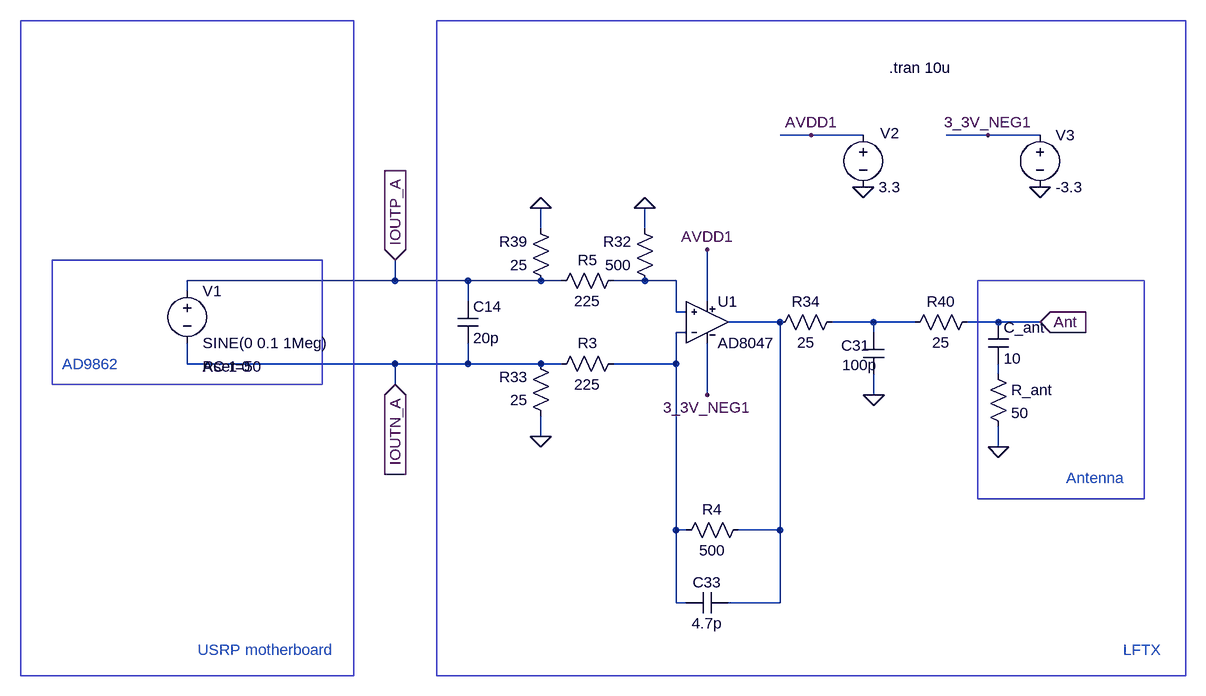
[diagram p0: schematic LFTX-AD8047.asc]
LFTX-AD8047.asc, the LTspice schematic file:
Version 4
SHEET 1 1508 724
WIRE -96 -112 -144 -112
WIRE -16 -112 -96 -112
WIRE 176 -112 112 -112
WIRE 256 -112 176 -112
WIRE -512 32 -512 0
WIRE -352 32 -352 0
WIRE -736 112 -736 80
WIRE -736 112 -1056 112
WIRE -624 112 -736 112
WIRE -512 112 -624 112
WIRE -480 112 -512 112
WIRE -352 112 -400 112
WIRE -304 112 -352 112
WIRE -1056 128 -1056 112
WIRE -624 144 -624 112
WIRE -256 144 -256 64
WIRE -304 160 -304 112
WIRE -288 160 -304 160
WIRE -144 176 -224 176
WIRE 0 176 -64 176
WIRE 64 176 0 176
WIRE 192 176 144 176
WIRE 256 176 192 176
WIRE -288 192 -304 192
WIRE 0 192 0 176
WIRE -1056 240 -1056 208
WIRE -736 240 -1056 240
WIRE -624 240 -624 208
WIRE -624 240 -736 240
WIRE -512 240 -624 240
WIRE -480 240 -512 240
WIRE -304 240 -304 192
WIRE -304 240 -400 240
WIRE 192 256 192 240
WIRE -736 272 -736 240
WIRE -256 288 -256 208
WIRE 0 288 0 256
WIRE -512 352 -512 320
WIRE 192 368 192 336
WIRE -304 496 -304 240
WIRE -288 496 -304 496
WIRE -144 496 -144 176
WIRE -144 496 -208 496
WIRE -304 608 -304 496
WIRE -288 608 -304 608
WIRE -144 608 -144 496
WIRE -144 608 -224 608
FLAG -512 0 0
FLAG -352 0 0
FLAG 256 176 Ant
IOPIN 256 176 In
FLAG -512 352 0
FLAG -96 -112 AVDD1
FLAG -16 -32 0
FLAG -736 80 IOUTP_A
IOPIN -736 80 In
FLAG -736 272 IOUTN_A
IOPIN -736 272 In
FLAG 256 -32 0
FLAG 176 -112 3_3V_NEG1
FLAG -256 64 AVDD1
FLAG -256 288 3_3V_NEG1
FLAG 0 288 0
FLAG 192 368 0
SYMBOL res -384 96 R90
WINDOW 0 0 56 VBottom 0
WINDOW 3 32 56 VTop 0
SYMATTR InstName R5
SYMATTR Value 225
SYMATTR SpiceLine tol=1 pwr=0.1
SYMBOL res -496 336 R180
WINDOW 0 36 76 Left 0
WINDOW 3 36 40 Left 0
SYMATTR InstName R33
SYMATTR Value 25
SYMATTR SpiceLine tol=1 pwr=0.1
SYMBOL res -336 128 R180
WINDOW 0 36 76 Left 0
WINDOW 3 36 40 Left 0
SYMATTR InstName R32
SYMATTR Value 500
SYMATTR SpiceLine tol=1 pwr=0.1
SYMBOL res -496 256 R270
WINDOW 0 32 56 VTop 0
WINDOW 3 0 56 VBottom 0
SYMATTR InstName R3
SYMATTR Value 225
SYMATTR SpiceLine tol=1 pwr=0.1
SYMBOL res 160 160 R90
WINDOW 0 0 56 VBottom 0
WINDOW 3 32 56 VTop 0
SYMATTR InstName R40
SYMATTR Value 25
SYMATTR SpiceLine tol=1 pwr=0.1
SYMBOL res -496 128 R180
WINDOW 0 36 76 Left 0
WINDOW 3 36 40 Left 0
SYMATTR InstName R39
SYMATTR Value 25
SYMATTR SpiceLine tol=1 pwr=0.1
SYMBOL res -48 160 R90
WINDOW 0 0 56 VBottom 0
WINDOW 3 32 56 VTop 0
SYMATTR InstName R34
SYMATTR Value 25
SYMATTR SpiceLine tol=1 pwr=0.1
SYMBOL cap -16 192 R0
WINDOW 0 -34 20 Left 0
WINDOW 3 -32 50 Left 0
SYMATTR InstName C31
SYMATTR Value 100p
SYMBOL voltage -1056 112 R0
WINDOW 123 24 132 Left 0
WINDOW 39 24 132 Left 0
SYMATTR Value2 AC 1 0
SYMATTR SpiceLine Rser=50
SYMATTR InstName V1
SYMATTR Value SINE(0 0.1 1Meg)
SYMBOL voltage -16 -128 R0
WINDOW 123 0 0 Left 0
WINDOW 39 0 0 Left 0
WINDOW 0 26 13 Left 0
SYMATTR InstName V2
SYMATTR Value 3.3
SYMBOL cap -640 144 R0
SYMATTR InstName C14
SYMATTR Value 20p
SYMBOL AD8047 -256 112 R0
SYMATTR InstName U1
SYMBOL voltage 256 -128 R0
WINDOW 123 0 0 Left 0
WINDOW 39 0 0 Left 0
SYMATTR InstName V3
SYMATTR Value -3.3
SYMBOL res -192 480 R90
WINDOW 0 0 56 VBottom 0
WINDOW 3 32 56 VTop 0
SYMATTR InstName R4
SYMATTR Value 500
SYMATTR SpiceLine tol=1 pwr=0.1
SYMBOL cap -224 592 R90
WINDOW 0 0 32 VBottom 0
WINDOW 3 32 32 VTop 0
SYMATTR InstName C33
SYMATTR Value 4.7p
SYMBOL cap 176 176 R0
SYMATTR InstName C_ant
SYMATTR Value 10
SYMBOL res 176 240 R0
SYMATTR InstName R_ant
SYMATTR Value 50
TEXT 24 -216 Left 0 !.tran 10u
TEXT -1248 240 Left 0 ;AD9862
TEXT 296 416 Left 0 ;Antenna
TEXT 384 680 Left 0 ;LFTX
TEXT -1040 680 Left 0 ;USRP motherboard
RECTANGLE Normal -1264 272 -848 80
RECTANGLE Normal 416 448 160 112
RECTANGLE Normal -672 720 480 -288
RECTANGLE Normal -1312 720 -800 -288

The netlist it stands for:
* LFTX-AD8047.asc
R5 N001 IOUTP_A 225 tol=1 pwr=0.1
R33 0 IOUTN_A 25 tol=1 pwr=0.1
R32 N001 0 500 tol=1 pwr=0.1
R3 IOUTN_A N004 225 tol=1 pwr=0.1
R40 Ant N003 25 tol=1 pwr=0.1
R39 IOUTP_A 0 25 tol=1 pwr=0.1
R34 N003 N002 25 tol=1 pwr=0.1
C31 N003 0 100p
V1 IOUTP_A IOUTN_A SINE(0 0.1 1Meg) AC 1 0 Rser=50
V2 AVDD1 0 3.3
C14 IOUTP_A IOUTN_A 20p
XU1 N001 N004 AVDD1 3_3V_NEG1 N002 AD8047  ; pins In+ In- V+ V- OUT
V3 3_3V_NEG1 0 -3.3
R4 N002 N004 500 tol=1 pwr=0.1
C33 N002 N004 4.7p
C_ant Ant N005 10
R_ant N005 0 50
.tran 10u
* AD9862
* Antenna
* LFTX
* USRP motherboard
.backanno
.end